# Altium schematic sheet ProtectionAndShunt.SchDoc
size A4
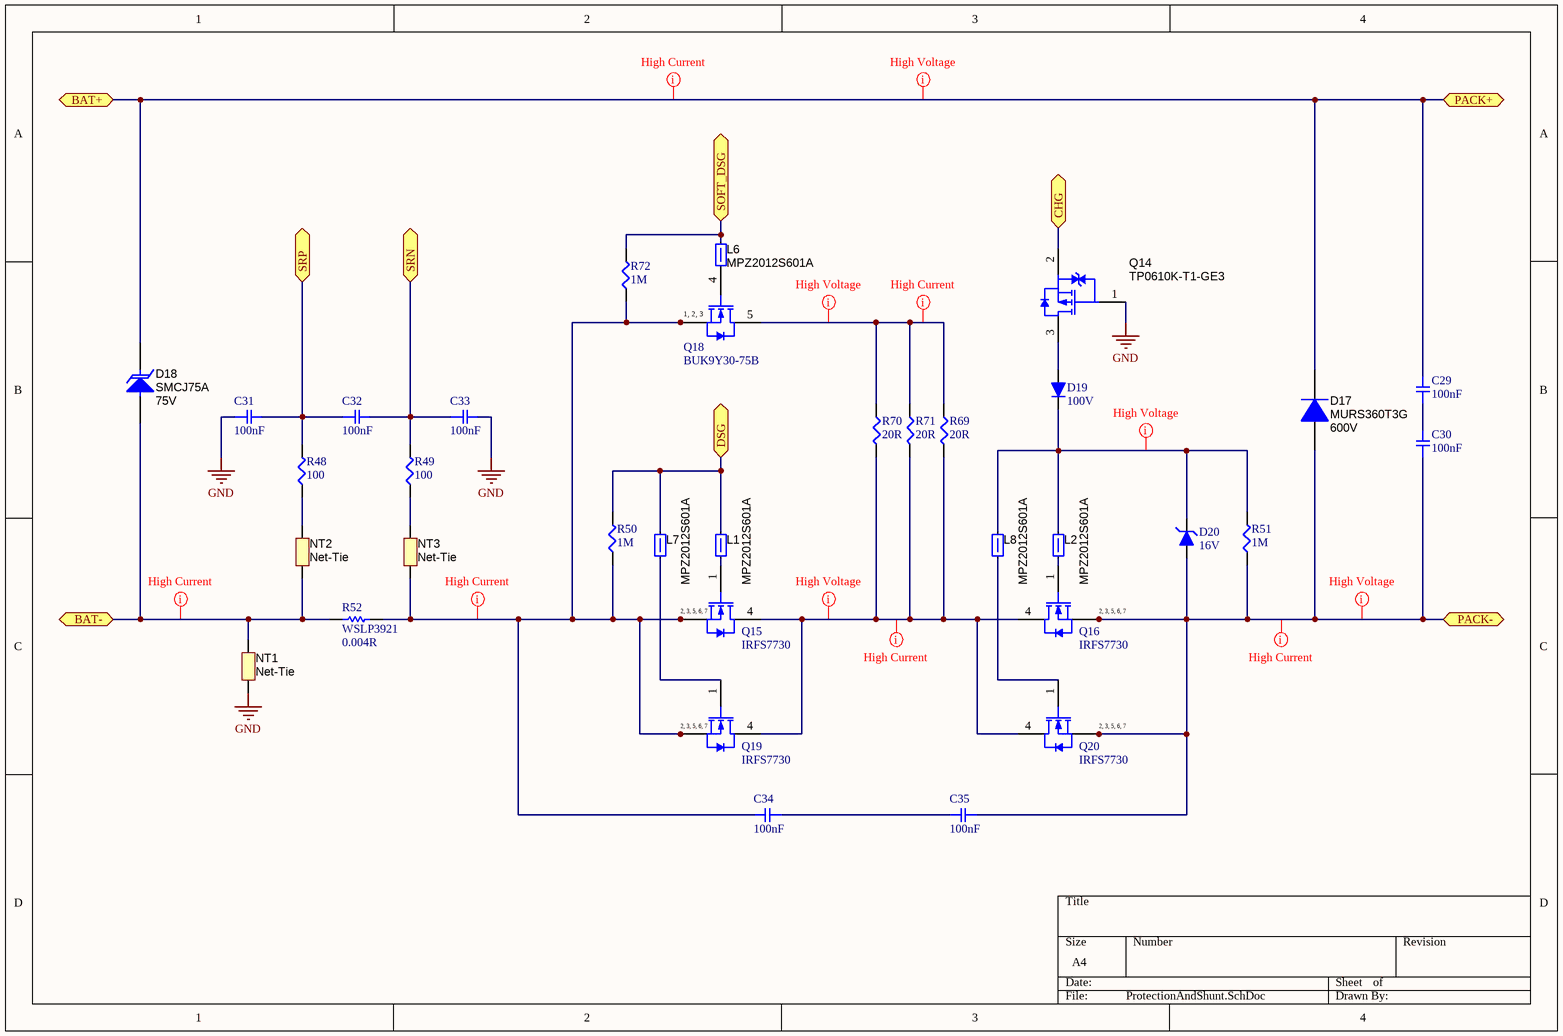
[diagram p0: ProtectionAndShunt.SchDoc]

## Parts
C29  100nF  [SMD-0603C]
C30  100nF  [SMD-0603C]
C31  100nF  [SMD-0603C]
C32  100nF  [SMD-0603C]
C33  100nF  [SMD-0603C]
C34  100nF  [SMD-0603C]
C35  100nF  [SMD-0603C]
D17  MURS360T3G  value 600V  [SMC]
D18  SMCJ75A  value 75V  [SMC]
D19  100V  [SOD-323]
D20  16V  [SOD-323]
L1  MPZ2012S601A  [SMD-0805-RES]
L2  MPZ2012S601A  [SMD-0805-RES]
L6  MPZ2012S601A  [SMD-0805-RES]
L7  MPZ2012S601A  [SMD-0805-RES]
L8  MPZ2012S601A  [SMD-0805-RES]
NT1  Net-Tie  [Net-Tie_10mil]  (net tie, no BOM)
NT2  Net-Tie  [Net-Tie_10mil]  (net tie, no BOM)
NT3  Net-Tie  [Net-Tie_10mil]  (net tie, no BOM)
Q14  TP0610K-T1-GE3  [SOT23-3]
Q15  IRFS7730  [INF-PG-TO263-7-3_N]
Q16  IRFS7730  [INF-PG-TO263-7-3_N]
Q18  BUK9Y30-75B  [NXP-SOT669_N]
Q19  IRFS7730  [INF-PG-TO263-7-3_N]
Q20  IRFS7730  [INF-PG-TO263-7-3_N]
R48  100  [SMD-0603-RES]
R49  100  [SMD-0603-RES]
R50  1M  [SMD-0603-RES]
R51  1M  [SMD-0603-RES]
R52  WSLP3921  value 0.004R  [WSLP3921]
R69  20R  [SMD-1206-RES]
R70  20R  [SMD-1206-RES]
R71  20R  [SMD-1206-RES]
R72  1M  [SMD-0603-RES]

## Ports
BAT+, BAT-, CHG, DSG, PACK+, PACK-, SOFT_DSG, SRN, SRP

## Nets
GND: C31.1 C33.2 NT1.1 Q14.1(G)
BAT+: C29.2 D17.1(K) D18.1(K) ; port BAT+, port PACK+
BAT-: D18.2(A) NT1.2 NT2.1 R52.1 ; port BAT-
CHG: Q14.2(S) ; port CHG
DSG: L1.2 L7.2 R50.2 ; port DSG
PACK-: C30.1 C35.1 D17.2(A) D20.2(A) Q16.2(SOURCE) Q16.3(SOURCE) Q16.5(SOURCE) Q16.6(SOURCE) Q16.7(SOURCE) Q20.2(SOURCE) Q20.3(SOURCE) Q20.5(SOURCE) Q20.6(SOURCE) Q20.7(SOURCE) R51.1 ; port PACK-
SOFT_DSG: L6.2 R72.2 ; port SOFT_DSG
SRN: C32.2 C33.1 R49.2 ; port SRN
SRP: C31.2 C32.1 R48.2 ; port SRP
NetC29_1: C29.1 C30.2
NetC34_1: C34.1 C35.2
NetC34_2: C34.2 NT3.1 Q15.2(SOURCE) Q15.3(SOURCE) Q15.5(SOURCE) Q15.6(SOURCE) Q15.7(SOURCE) Q18.1(S) Q18.2(S) Q18.3(S) Q19.2(SOURCE) Q19.3(SOURCE) Q19.5(SOURCE) Q19.6(SOURCE) Q19.7(SOURCE) R50.1 R52.2 R72.1
NetD19_1: D19.1(K) D20.1(K) L2.2 L8.2 R51.2
NetD19_2: D19.2(A) Q14.3(D)
NetL1_1: L1.1 Q15.1(GATE)
NetL2_1: L2.1 Q16.1(GATE)
NetL6_1: L6.1 Q18.4(G)
NetL7_1: L7.1 Q19.1(GATE)
NetL8_1: L8.1 Q20.1(GATE)
NetNT2_2: NT2.2 R48.1
NetNT3_2: NT3.2 R49.1
NetQ15_4: Q15.4(DRAIN) Q16.4(DRAIN) Q19.4(DRAIN) Q20.4(DRAIN) R69.2 R70.2 R71.2
NetQ18_5: Q18.5(D) R69.1 R70.1 R71.1

## Layout directives
net class High Voltage: BAT+, NetD19_1, NetQ15_4, NetQ18_5, PACK-
net class High Current: BAT+, BAT-, NetC34_2, NetQ15_4, NetQ18_5, PACK-

## Notes on the sheet
- (in symbol BUK9Y30-75B,115) 1, 2, 3
- (in symbol IPB180N04S3-02) 2, 3, 5, 6, 7

## Library data of the parts
C29-C35 = GCJ188R71C104KA01D: CAP CER 0.1UF 16V X7R 0603; Manufacturer: Murata Electronics North America; Factory Stock: 0; Unit Price (USD): 0.21; Minimum Quantity: 1; Value: 0.10µF; Tolerance: ±10%; Datasheets: http://www.murata.com/~/media/webrenewal/support/library/catalog/products/capacitor/mlcc/c03e.ashx; Image: //media.digikey.com/Renders/Murata%20Renders/0603%28LQG18%29.jpg; Digi-Key Part Number: 490-5796-1-ND; Part Number: GCJ188R71C104KA01D; Quantity Available: 22473; @ qty: 0; Packaging: Cut Tape (CT); Series: GCJ; Part Status: Active; Voltage: 16V; Temperature Coefficient: X7R; Operating Temperature: -55°C ~ 125°C; Features: Soft Termination; Ratings: AEC-Q200; Applications: Automotive, Boardflex Sensitive; Mounting Type: Surface Mount, MLCC; Package / Case: 0603 (1608 Metric); Size / Dimension: 0.063" L x 0.031" W (1.60mm x 0.80mm); Height - Seated (Max): -; Thickness (Max): 0.035" (0.90mm); Lead Spacing: -; Lead Style: -
D17 = MURS360T3G: Diode, Ultrafast, 600V, 3A, SMC; Manufacturer: ON Semiconductor; U/M: EA; Vf_V: 1.25; Io_A: 3; Vr_V: 600; Value2: 1.25V; TJmax_C: 175; RJC_CperW: 11; CompType: Diode; PartNumber: MURS360T3G; SymbolVersion: 2008-12-08; MountType: SMT; RoHS: Y; PackageReference: SMC; Value1: 3A; Type: Ultrafast; Published: 2008-06-26; Publisher: Texas Instruments; LatestRevisionDate: 2014-01-16; ComponentLink1Description: Datasheet link; ComponentLink1URL: http://www.onsemi.com/pub/Collateral/MURS320T3-D.PDF; Supplier 1: Digi-Key; Supplier Part Number 1: MURS360T3GOSCT-ND; Supplier 2: Mouser; Supplier Part Number 2: 863-MURS360T3G; Supplier 3: Farnell; Supplier Part Number 3: 1459153
D18 = SMCJ75A: Diode, TVS, Uni, 75V, 1500W, SMC; Manufacturer: Fairchild Semiconductor; U/M: EA; Power_W: 1500; Vr_V: 75; CompType: TVS; SymbolVersion: 2012-01-13; PackageReference: SMC; PartNumber: SMCJ75A; RoHS: Y; MountType: SMT; ComponentLink1Description: Datasheet link; ComponentLink1URL: http://www.fairchildsemi.com/ds/SM/SMCJ100A.pdf; Publisher: Texas Instruments; LatestRevisionDate: 2013-10-23; LatestRevisionNote: Updated Supplier Data; Vz_V: N/A; Value1: 1500W; Published: 2008-10-08; Supplier 1: Digi-Key; Supplier Part Number 1: SMCJ75AFSCT-ND; Supplier 2: Mouser; Supplier Part Number 2: 512-SMCJ75A; Supplier 3: Farnell; Supplier Part Number 3: 9822992
D19 = DIODE
D20 = ZENER_16V: Zener Diode 16V
L1 L2 L6-L8 = BLM18SG221TN1D: Ferrite Bead; Manufacturer: MuRata; Imax_A: 2.5; DCR_ohm: 0.04; Value1: 0.04 ohm; Value2: 2.5A; ZTyp@100MHz_Ohm: 220; Value: 220 ohm; CompType: Ferrite Bead; SymbolVersion: 2009-06-02; PartNumber: BLM18SG221TN1D; MountType: SMT; PackageReference: 0603; Published: 2014-04-30; Publisher: Texas Instruments; LatestRevisionDate: 2015-05-26; ComponentLink1Description: Datasheet link; ComponentLink1URL: http://search.murata.co.jp/Ceramy/image/img/PDF/ENG/L0110S0100BLM18S.pdf; RoHS: Y; Supplier 1: Digi-Key; Supplier Part Number 1: 490-5225-1-ND; Supplier 2: Mouser; Supplier Part Number 2: 81-BLM18SG221TN1D; Supplier 3: Farnell; Supplier Part Number 3: 1515753
NT1-NT3 = Net-Tie: Single point connection between nets.; SymbolCreator: codlsc; SymbolVersion: 2009-07-01; MountType: SMT; Publisher: Texas Instruments; LatestRevisionDate: 2012-11-28; LatestRevisionNote: Added Alternate PartNumber and Alternate Manufacturer parameters to appropriate components.
Q14 = TP0610K-T1-GE3: MOSFET, P-CH, -60 V, -0.185 A, SOT-23; Manufacturer: Vishay-Siliconix; Alternate Manufacturer: None; SymbolCreator: a0411947; U/M: EA; ChType: P; Value: -60V; Value1: 10 ohm; Rdson45_ohm: 10; Value2: 1.7 nC; QgTyp_nC: 1.7; Vgs_V: 20; SymbolVersion: 2013-05-16; PartNumber: TP0610K-T1-GE3; PackageReference: SOT-23; CompType: MOSFET; VdsMax_V: -60; IdsMax_A: -0.185; RoHS: Y; MountType: SMT; Published: 2008-06-19; Publisher: Texas Instruments; LatestRevisionDate: 2015-06-05; LatestRevisionNote: Added parts.; ComponentLink1Description: Datasheet link; ComponentLink1URL: http://www.vishay.com/docs/71411/tp0610k.pdf; Supplier 1: Digi-Key; Supplier Part Number 1: TP0610K-T1-GE3CT-ND; Supplier 2: Mouser; Supplier Part Number 2: 781-TP0610K-T1-GE3; Supplier 3: Farnell; Supplier Part Number 3: 1794816
Q15 Q16 Q19 Q20 = IPB180N04S3-02: OptiMOS-T Power-Transistor, 40 V VDS, 180 A ID, PG-TO263-7-3, Reel, Green; Manufacturer: Infineon; Green: TRUE; ID (max): 180 A; IDpuls (max): 720 A; Ptot (max): 300 W; QG: 160 nC; RDS (on) (max) (@10V): 1.5 mOhm; RthJC (max): 0.5 K/W; VDS (max): 40 V; VGS(th) (max): 4 V; VGS(th) (min): 2.1 V; DatasheetVersion: Rev. 1.0; PackageReference: PG-TO263-7-3; PackageDescription: 7-Pin Plastic (Green) Transistor Single Outline Package, 10 x 9.25 mm Body, 1.27 mm Pitch; Supplier 1: Mouser; Supplier Part Number 1: 726-IPB180N04S302; Supplier 2: Digi-Key; Supplier Part Number 2: IPB180N04S3-02TR-ND; Supplier 3: Digi-Key; Supplier Part Number 3: IPB180N04S3-02CT-ND; Supplier 4: Digi-Key; Supplier Part Number 4: IPB180N04S3-02DKR-ND; Halogen-free: TRUE; Packing: Reel; Technology: OptiMOS-T; Mounting Technology: Surface Mount; PartNumber: IPB180N04S3-02; ComponentLink1Description: Manufacturer URL; ComponentLink1URL: http://www.infineon.com/; ComponentLink2Description: Datasheet; ComponentLink2URL: http://www.infineon.com/dgdl/IPB180N04S3-02_DS_1_0.pdf?folderId=db3a304412b407950112b42b75b74520&fileId=db3a304412b407950112b42ba6cf45ab&location=en.Products.Automotive_ICs.Automotive_MOSFETs.Single__N-Channel_40V_MOSFETs.DATASHEET.IPB180N04S3-02_DS_1_0.pdf; ComponentLink3Description: Package Specification; ComponentLink3URL: http://www.infineon.com/cms/packages/SMD_-_Surface_Mounted_Devices/P-PG-TO263/P-TO263-07-02x_-3.html?__locale=en
Q18 = BUK9Y30-75B,115: N-Channel TrenchMOS Logic Level FET, 75 V, 34 A, 5-Pin SOT669, Tape and Reel; Manufacturer: NXP Semiconductors; Automotive Qualified: Y; Channel Type: N; ID [max] (A): 34; IDM [max] (A): 137; Packing: Tape & Reel; Qr [typ] (nC): 115; VDS [max] (V): 75; VGSth [typ] (V): 1.5; DatasheetVersion: Rev. 04; PackageVersion: 13-02-27, 02/2013; PackageReference: SOT669; PackageDescription: 4-Pin Plastic Single-ended Surface Mounted Package, Body 4.9 x 3.95 mm, Pitch 1.27 mm; Supplier 1: Digi-Key; Supplier Part Number 1: 568-6236-2-ND; Supplier 2: Digi-Key; Supplier Part Number 2: 568-6236-1-ND; Supplier 3: Digi-Key; Supplier Part Number 3: 568-6236-6-ND; Supplier 4: Newark; Supplier Part Number 4: 79R1855; Supplier 5: Mouser; Supplier Part Number 5: 771-BUK9Y30-75B115; Mounting Technology: Surface Mount; Code_JEDEC: MO-235; PartNumber: BUK9Y30-75B,115; ComponentLink1Description: Manufacturer URL; ComponentLink1URL: http://www.nxp.com/; ComponentLink2Description: Datasheet; ComponentLink2URL: http://www.nxp.com/documents/data_sheet/BUK9Y30-75B.pdf; ComponentLink3Description: Package Specification; ComponentLink3URL: http://www.nxp.com/documents/outline_drawing/sot669_po.pdf
R48 R49 = ERJ-3EKF1000V: RES SMD 100 OHM 1% 1/10W 0603; Manufacturer: Panasonic Electronic Components; Factory Stock: 0; Unit Price (USD): 0.00379; @ qty: 1500; Minimum Quantity: 1; Power (Watts): 0.1W, 1/10W; Temperature Coefficient: ±100ppm/°C; Part Number: ERJ-3EKF1000V; Datasheets: http://industrial.panasonic.com/www-cgi/jvcr13pz.cgi?E+PZ+3+AOA0002+ERJ3EKF1000V+7+WW; Image: //media.digikey.com/Photos/Panasonic%20Photos/MFG_ERJ-P6W%20Series.jpg; Digi-Key Part Number: P100HCT-ND; Quantity Available: 1544120; Packaging: Cut Tape (CT); Series: ERJ; Part Status: Active; Value: 100; Tolerance: ±1%; Composition: Thick Film; Features: Automotive AEC-Q200; Operating Temperature: -55°C ~ 155°C; Package / Case: 0603 (1608 Metric); Supplier Device Package: 0603; Size / Dimension: 0.063" L x 0.031" W (1.60mm x 0.80mm); Height - Seated (Max): 0.022" (0.55mm); Number of Terminations: 2; Failure Rate: -
R50 R51 R72 = ERJ-3GEYJ105V: RES SMD 1M OHM 5% 1/10W 0603; Manufacturer: Panasonic Electronic Components; Factory Stock: 0; Unit Price (USD): 0.00321; @ qty: 1500; Minimum Quantity: 1; Power (Watts): 0.1W, 1/10W; Temperature Coefficient: ±200ppm/°C; Part Number: ERJ-3GEYJ105V; Datasheets: http://industrial.panasonic.com/www-cgi/jvcr13pz.cgi?E+PZ+3+AOA0001+ERJ3GEYJ105V+7+WW; Image: //media.digikey.com/Photos/Panasonic%20Photos/MFG_ERJ-P6W%20Series.jpg; Digi-Key Part Number: P1.0MGCT-ND; Quantity Available: 250051; Packaging: Cut Tape (CT); Series: ERJ; Part Status: Active; Value: 1M; Tolerance: ±5%; Composition: Thick Film; Features: Automotive AEC-Q200; Operating Temperature: -55°C ~ 155°C; Package / Case: 0603 (1608 Metric); Supplier Device Package: 0603; Size / Dimension: 0.063" L x 0.031" W (1.60mm x 0.80mm); Height - Seated (Max): 0.022" (0.55mm); Number of Terminations: 2; Failure Rate: -
R69-R71 = ERJ-8ENF20R0V: RES SMD 20 OHM 1% 1/4W 1206; Manufacturer: Panasonic Electronic Components; Factory Stock: 0; Unit Price (USD): 0.00933; @ qty: 1500; Minimum Quantity: 1; Value: 20; Power (Watts): 0.25W, 1/4W; Temperature Coefficient: ±100ppm/°C; Part Number: ERJ-8ENF20R0V; Datasheets: http://industrial.panasonic.com/www-cgi/jvcr13pz.cgi?E+PZ+3+AOA0002+ERJ8ENF20R0V+7+WW; Image: //media.digikey.com/Renders/Panasonic%20Renders/ERJ-1206%20Pkg.jpg; Digi-Key Part Number: P20.0FCT-ND; Quantity Available: 622513; Packaging: Cut Tape (CT); Series: ERJ; Part Status: Active; Tolerance: ±1%; Composition: Thick Film; Features: Automotive AEC-Q200; Operating Temperature: -55°C ~ 155°C; Package / Case: 1206 (3216 Metric); Supplier Device Package: 1206; Size / Dimension: 0.126" L x 0.063" W (3.20mm x 1.60mm); Height - Seated (Max): 0.028" (0.70mm); Number of Terminations: 2; Failure Rate: -